# Altium schematic sheet Archimedes_Ana_Sayfa.SchDoc: Ana Sayfa
size A4; DrawnBy: Emre Rasim; DocumentNumber: 4; Revision: 1.0; SheetNumber: 1; SheetTotal: 8; Takimismi: İTÜ Eklemeli İmalat Takımı; Projeismi: Project Archimedes; Sematikicerigi: Ana Sayfa; Versiyon: 1; Cizeni: Emre Rasim
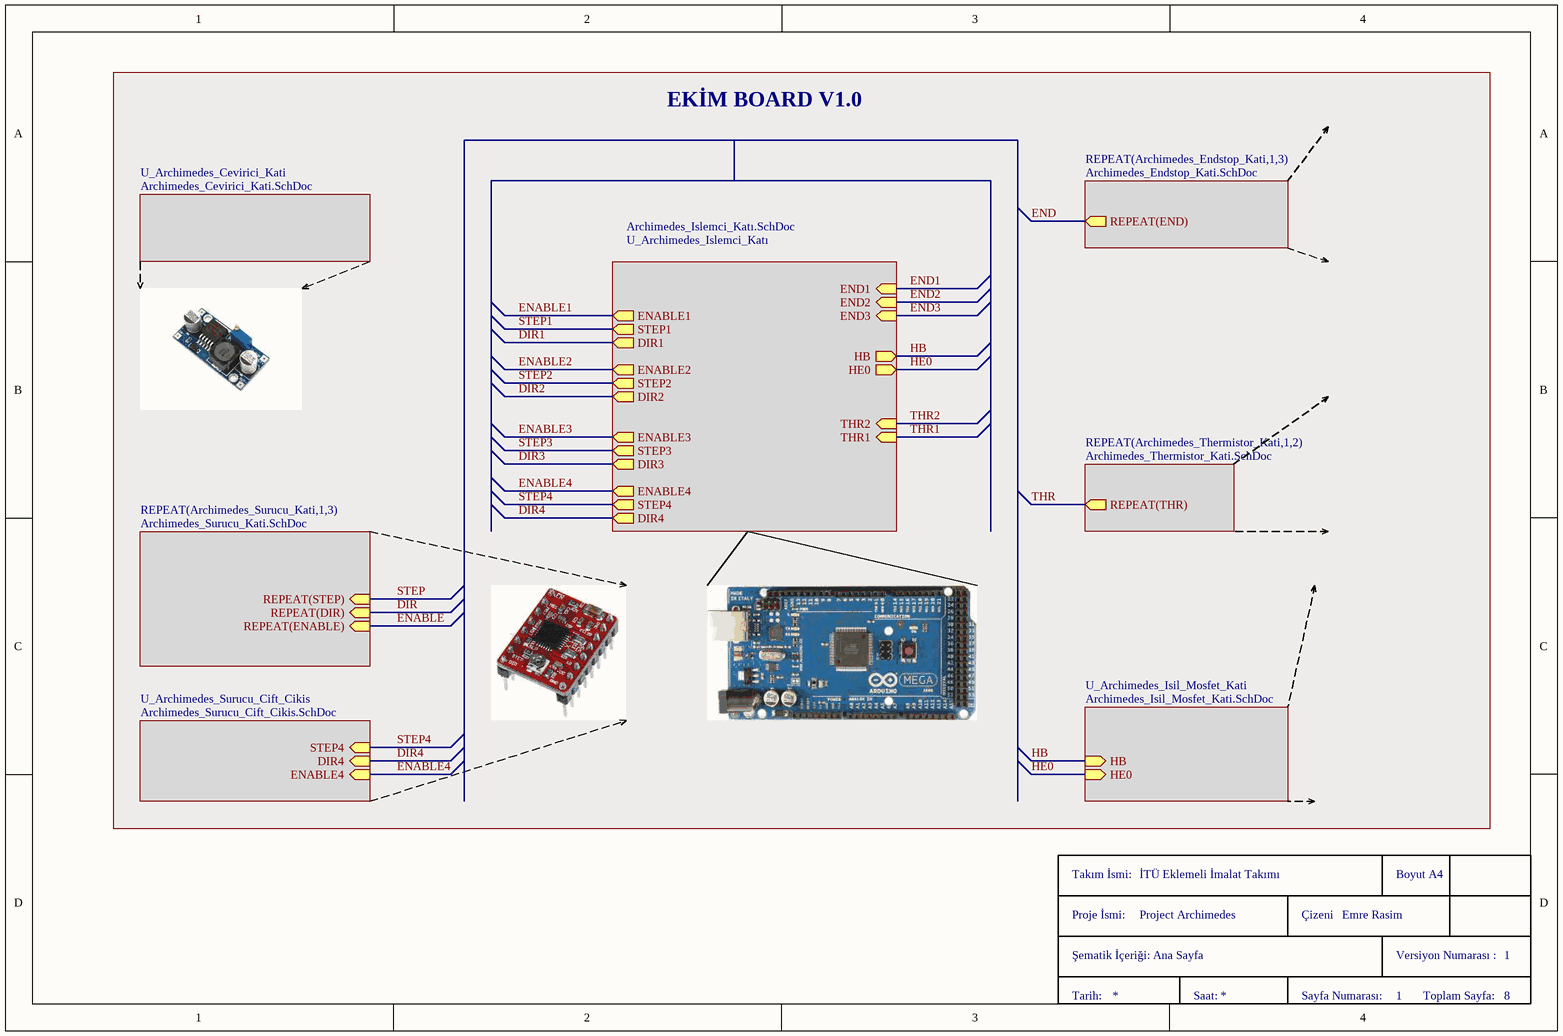
[diagram p0: Archimedes_Ana_Sayfa.SchDoc]

## Parts
TitleBlock-A4  TitleBlock-A4  (value not drawn)  (graphical)

## Sub-sheets
REPEAT(Archimedes_Endstop_Kati,1,3) = Archimedes_Endstop_Kati.SchDoc: REPEAT(END) (out)
REPEAT(Archimedes_Surucu_Kati,1,3) = Archimedes_Surucu_Kati.SchDoc: REPEAT(DIR) (in), REPEAT(STEP) (in), REPEAT(ENABLE) (in)
REPEAT(Archimedes_Thermistor_Kati,1,2) = Archimedes_Thermistor_Kati.SchDoc: REPEAT(THR) (out)
U_Archimedes_Cevirici_Kati = Archimedes_Cevirici_Kati.SchDoc: no entries
U_Archimedes_Isil_Mosfet_Kati = Archimedes_Isil_Mosfet_Kati.SchDoc: HB (in), HE0 (in)
U_Archimedes_Islemci_Katı = Archimedes_Islemci_Katı.SchDoc: ENABLE4 (out), STEP4 (out), DIR4 (out), ENABLE1 (out), STEP3 (out), DIR3 (out), END2 (in), END3 (in), END1 (in), HB (out), HE0 (out), THR2 (in), THR1 (in), ENABLE3 (out), DIR2 (out), STEP2 (out), ENABLE2 (out), DIR1 (out), STEP1 (out)
U_Archimedes_Surucu_Cift_Cikis = Archimedes_Surucu_Cift_Cikis.SchDoc: DIR4 (in), STEP4 (in), ENABLE4 (in)

## Nets
DIR: sheet REPEAT(Archimedes_Surucu_Kati,1,3)/REPEAT(DIR)
DIR1: sheet U_Archimedes_Islemci_Katı/DIR1
DIR2: sheet U_Archimedes_Islemci_Katı/DIR2
DIR3: sheet U_Archimedes_Islemci_Katı/DIR3
DIR4: sheet U_Archimedes_Islemci_Katı/DIR4, sheet U_Archimedes_Surucu_Cift_Cikis/DIR4
ENABLE: sheet REPEAT(Archimedes_Surucu_Kati,1,3)/REPEAT(ENABLE)
ENABLE1: sheet U_Archimedes_Islemci_Katı/ENABLE1
ENABLE2: sheet U_Archimedes_Islemci_Katı/ENABLE2
ENABLE3: sheet U_Archimedes_Islemci_Katı/ENABLE3
ENABLE4: sheet U_Archimedes_Islemci_Katı/ENABLE4, sheet U_Archimedes_Surucu_Cift_Cikis/ENABLE4
END: sheet REPEAT(Archimedes_Endstop_Kati,1,3)/REPEAT(END)
END1: sheet U_Archimedes_Islemci_Katı/END1
END2: sheet U_Archimedes_Islemci_Katı/END2
END3: sheet U_Archimedes_Islemci_Katı/END3
HB: sheet U_Archimedes_Islemci_Katı/HB, sheet U_Archimedes_Isil_Mosfet_Kati/HB
HE0: sheet U_Archimedes_Islemci_Katı/HE0, sheet U_Archimedes_Isil_Mosfet_Kati/HE0
STEP: sheet REPEAT(Archimedes_Surucu_Kati,1,3)/REPEAT(STEP)
STEP1: sheet U_Archimedes_Islemci_Katı/STEP1
STEP2: sheet U_Archimedes_Islemci_Katı/STEP2
STEP3: sheet U_Archimedes_Islemci_Katı/STEP3
STEP4: sheet U_Archimedes_Islemci_Katı/STEP4, sheet U_Archimedes_Surucu_Cift_Cikis/STEP4
THR: sheet REPEAT(Archimedes_Thermistor_Kati,1,2)/REPEAT(THR)
THR1: sheet U_Archimedes_Islemci_Katı/THR1
THR2: sheet U_Archimedes_Islemci_Katı/THR2

## Notes on the sheet
- EKİM BOARD V1.0
- (in symbol TitleBlock-A4) Takım İsmi:; Boyut A4; Proje İsmi:; Çizeni; Şematik İçeriği:; Versiyon Numarası :; Tarih:; Saat:; Sayfa Numarası:; Toplam Sayfa:

## Library data of the parts
TitleBlock-A4 = TitleBlock-A4: Title Block for İTU eklemeli imalat takımı